# EAGLE design a (EAGLE 9.6.2)
Assembly variants: basic
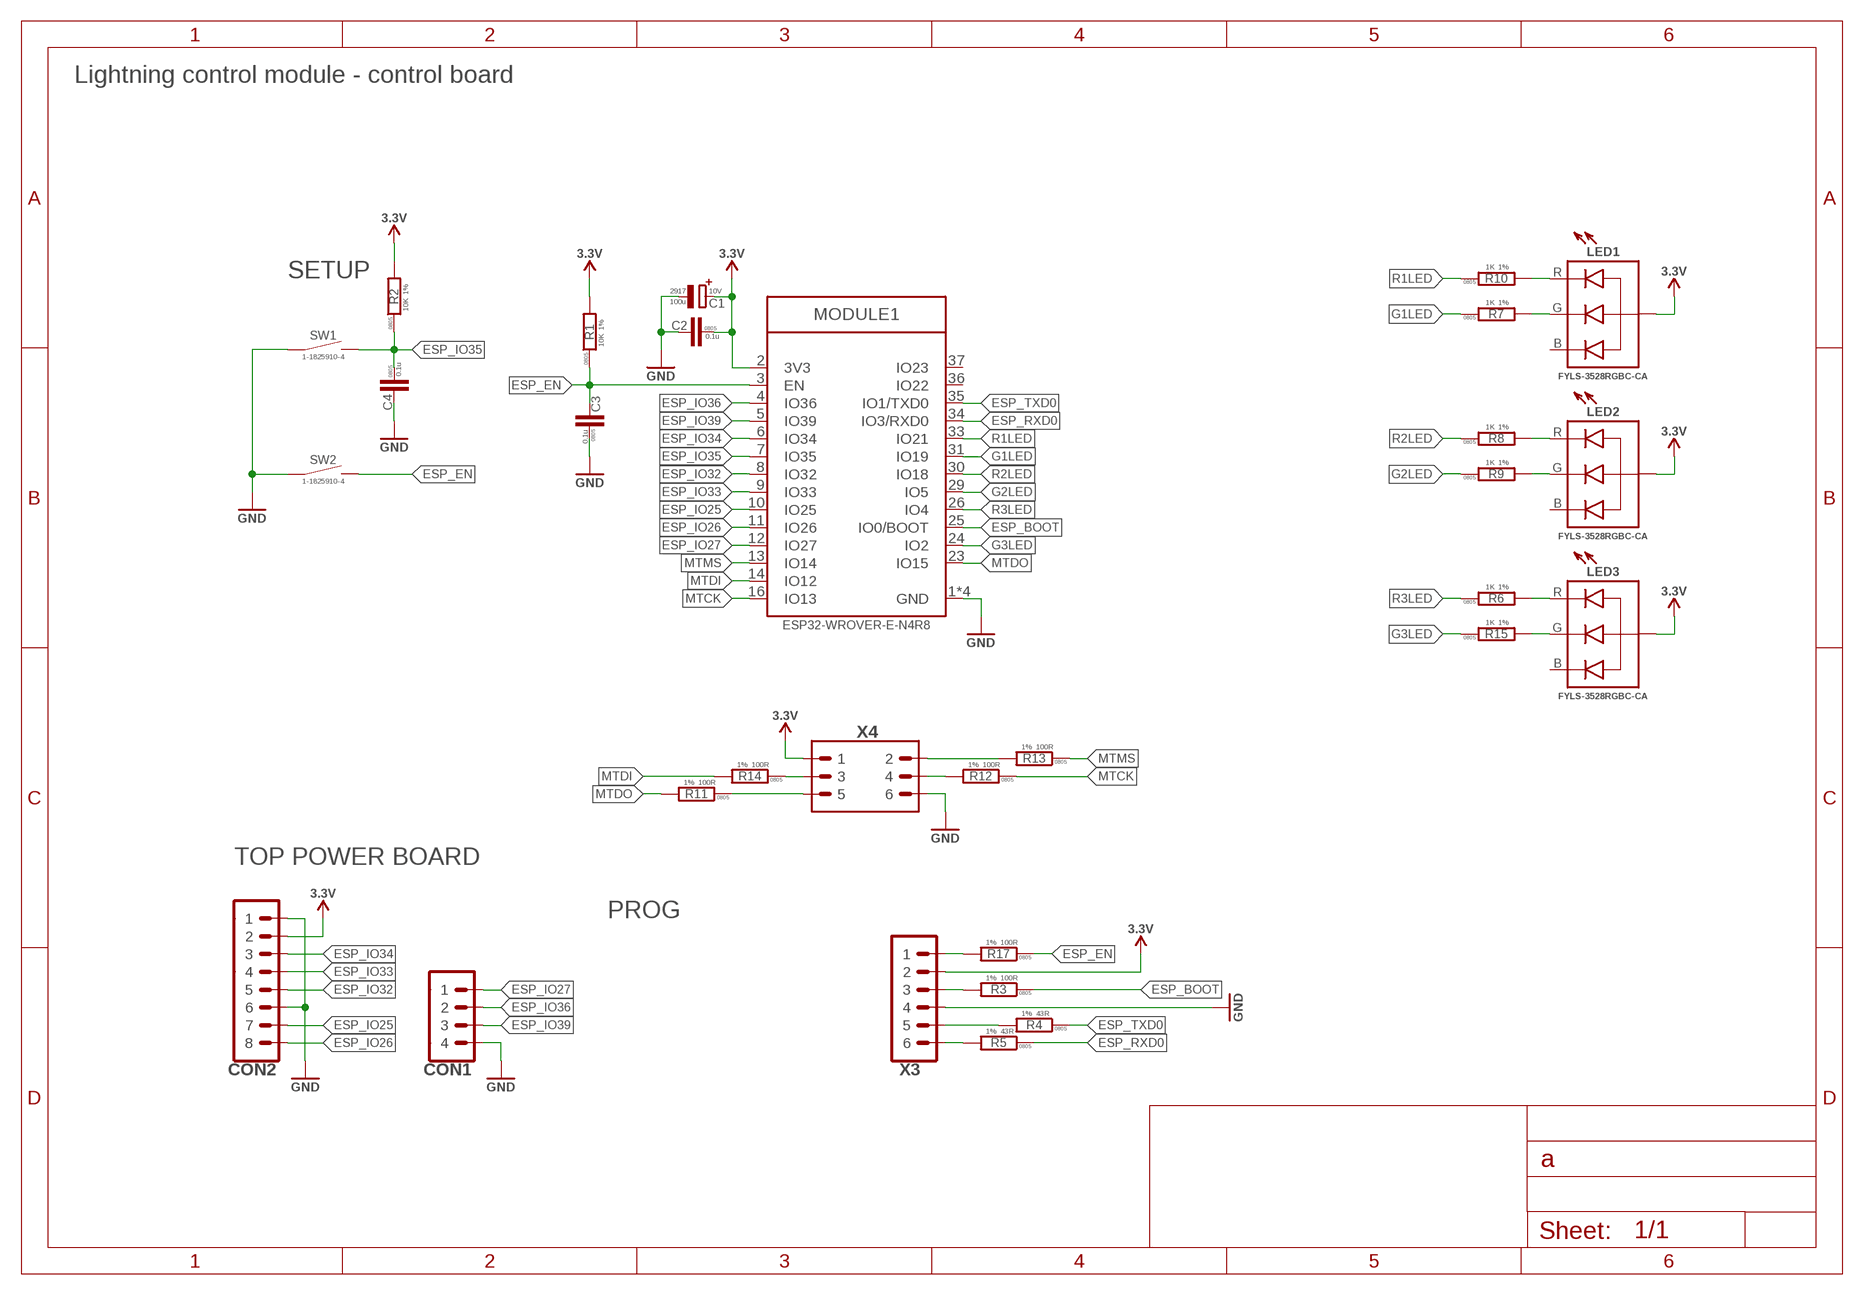
[diagram p0: schematic, sheet 1]

## Parts
C1  100u  CPOL-2917  [C2917]
C2  0.1u  C-0805  [C0805]
C3  0.1u  C-0805  [C0805]
C4  0.1u  C-0805  [C0805]
CON1  PINHEAD_1X04-2.54  [1X04-PTH-2.54]
CON2  PINHEAD_1X08-2.54  [1X08-PTH-2.54]
LED1  LED_RGB-3528  [LED3528]
LED2  LED_RGB-3528  [LED3528]
LED3  LED_RGB-3528  [LED3528]
MODULE1  ESP32-WROVER-(I)E  [ESP32-WROVER-E]
R1  10K  R-1%-0805  [R0805]
R2  10K  R-1%-0805  [R0805]
R3  100R  R-1%-0805  [R0805]
R4  43R  R-1%-0805  [R0805]
R5  43R  R-1%-0805  [R0805]
R6  1K  R-1%-0805  [R0805]
R7  1K  R-1%-0805  [R0805]
R8  1K  R-1%-0805  [R0805]
R9  1K  R-1%-0805  [R0805]
R10  1K  R-1%-0805  [R0805]
R11  100R  R-1%-0805  [R0805]
R12  100R  R-1%-0805  [R0805]
R13  100R  R-1%-0805  [R0805]
R14  100R  R-1%-0805  [R0805]
R15  1K  R-1%-0805  [R0805]
R17  100R  R-1%-0805  [R0805]
SW1  TACT_SWITCH-1-1825910-4  [1-1825910-4]
SW2  TACT_SWITCH-1-1825910-4  [1-1825910-4]
X3  PINHEAD_1X06-2-MALE  [1X06-PTH-2]
X4  PINHEAD_2X03-PTH-2.54  [2X03-PTH-2.54]

## Nets
ESP_BOOT: MODULE1.25(IO0/BOOT) R3.1
ESP_EN: C3.2 MODULE1.3(EN) R1.1 R17.1 SW2.3 SW2.4
ESP_IO25: CON2.7 MODULE1.10(IO25)
ESP_IO26: CON2.8 MODULE1.11(IO26)
ESP_IO27: CON1.1 MODULE1.12(IO27)
ESP_IO32: CON2.5 MODULE1.8(IO32)
ESP_IO33: CON2.4 MODULE1.9(IO33)
ESP_IO34: CON2.3 MODULE1.6(IO34)
ESP_IO35: C4.1 MODULE1.7(IO35) R2.1 SW1.3 SW1.4
ESP_IO36: CON1.2 MODULE1.4(IO36)
ESP_IO39: CON1.3 MODULE1.5(IO39)
ESP_RXD0: MODULE1.34(IO3/RXD0) R5.1
ESP_TXD0: MODULE1.35(IO1/TXD0) R4.1
G1LED: MODULE1.31(IO19) R7.1
G2LED: MODULE1.29(IO5) R9.1
G3LED: MODULE1.24(IO2) R15.1
GND: C1.- C2.2 C3.1 C4.2 CON1.4 CON2.1 CON2.6 MODULE1.1(GND) MODULE1.15(GND) MODULE1.38(GND) MODULE1.39(GND) SW1.1 SW1.2 SW2.1 SW2.2 X3.4 X4.6
MTCK: MODULE1.16(IO13) R12.1
MTDI: MODULE1.14(IO12) R14.2
MTDO: MODULE1.23(IO15) R11.2
MTMS: MODULE1.13(IO14) R13.1
N$1: LED2.1(R) R8.2
N$2: R13.2 X4.2
N$3: R5.2 X3.6
N$4: R4.2 X3.5
N$5: R3.2 X3.3
N$6: R12.2 X4.4
N$7: LED1.1(R) R10.2
N$8: LED1.4(G) R7.2
N$9: LED2.4(G) R9.2
N$10: LED3.1(R) R6.2
N$11: LED3.4(G) R15.2
N$14: R14.1 X4.3
N$15: R11.1 X4.5
N$17: R17.2 X3.1
R1LED: MODULE1.33(IO21) R10.1
R2LED: MODULE1.30(IO18) R8.1
R3LED: MODULE1.26(IO4) R6.1
VDD_3V3: C1.+ C2.1 CON2.2 LED1.2(A) LED2.2(A) LED3.2(A) MODULE1.2(3V3) R1.2 R2.2 X3.2 X4.1 ; supply symbol labelled 3.3V
Unconnected: LED1.3(B) LED2.3(B) LED3.3(B) MODULE1.36(IO22) MODULE1.37(IO23)

## Notes on the sheet
- Lightning control module - control board
- SETUP
- TOP POWER BOARD
- PROG

## Library data of the parts
C1 = rc:CPOL: Polar electrolytic or tantalum capacitor; PACKAGE: 2917; VOLTAGE: 10V
C2-C4 = rc:C; PACKAGE: 0805
CON1 = pinhead:PINHEAD_1X04
CON2 = pinhead:PINHEAD_1X08: pinheader 8P
LED1-LED3 = rc:LED_RGB; MANF: Foryard; MANF#: FYLS-3528RGBC-CA
MODULE1 = ali_modules:ESP32-WROVER-(I)E: ESP32-WROVER-(I)E module Datasheet <https://documentation.espressif.com/esp32-wrover-e_esp32-wrover-ie_datasheet_en.pdf>; MANF: Espressif Systems; MANF#: ESP32-WROVER-E-N4R8
R1-R15 R17 = rc:R; PACKAGE: 0805; TOLERANCE: 1%
SW1 SW2 = mechanical:TACT_SWITCH: tact switch; MANF: TE Connectivity; MANF#: 1-1825910-4
X3 = pinhead:PINHEAD_1X06: pinheader 6P
X4 = pinhead:PINHEAD_2X03

## Board
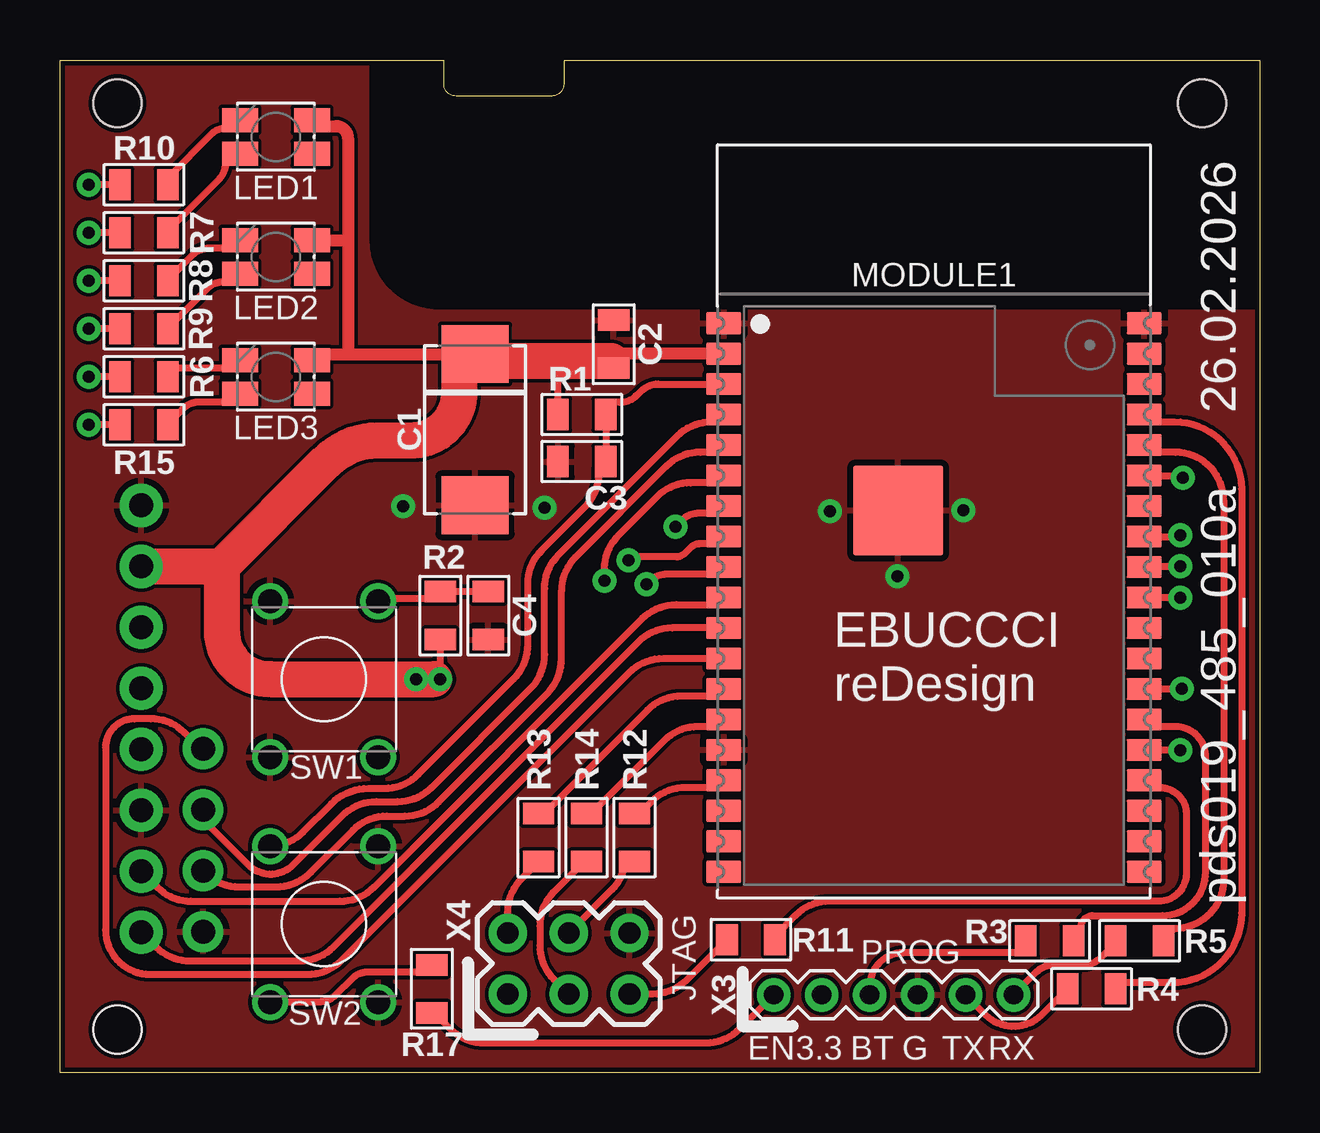
[diagram p1: board, top side]
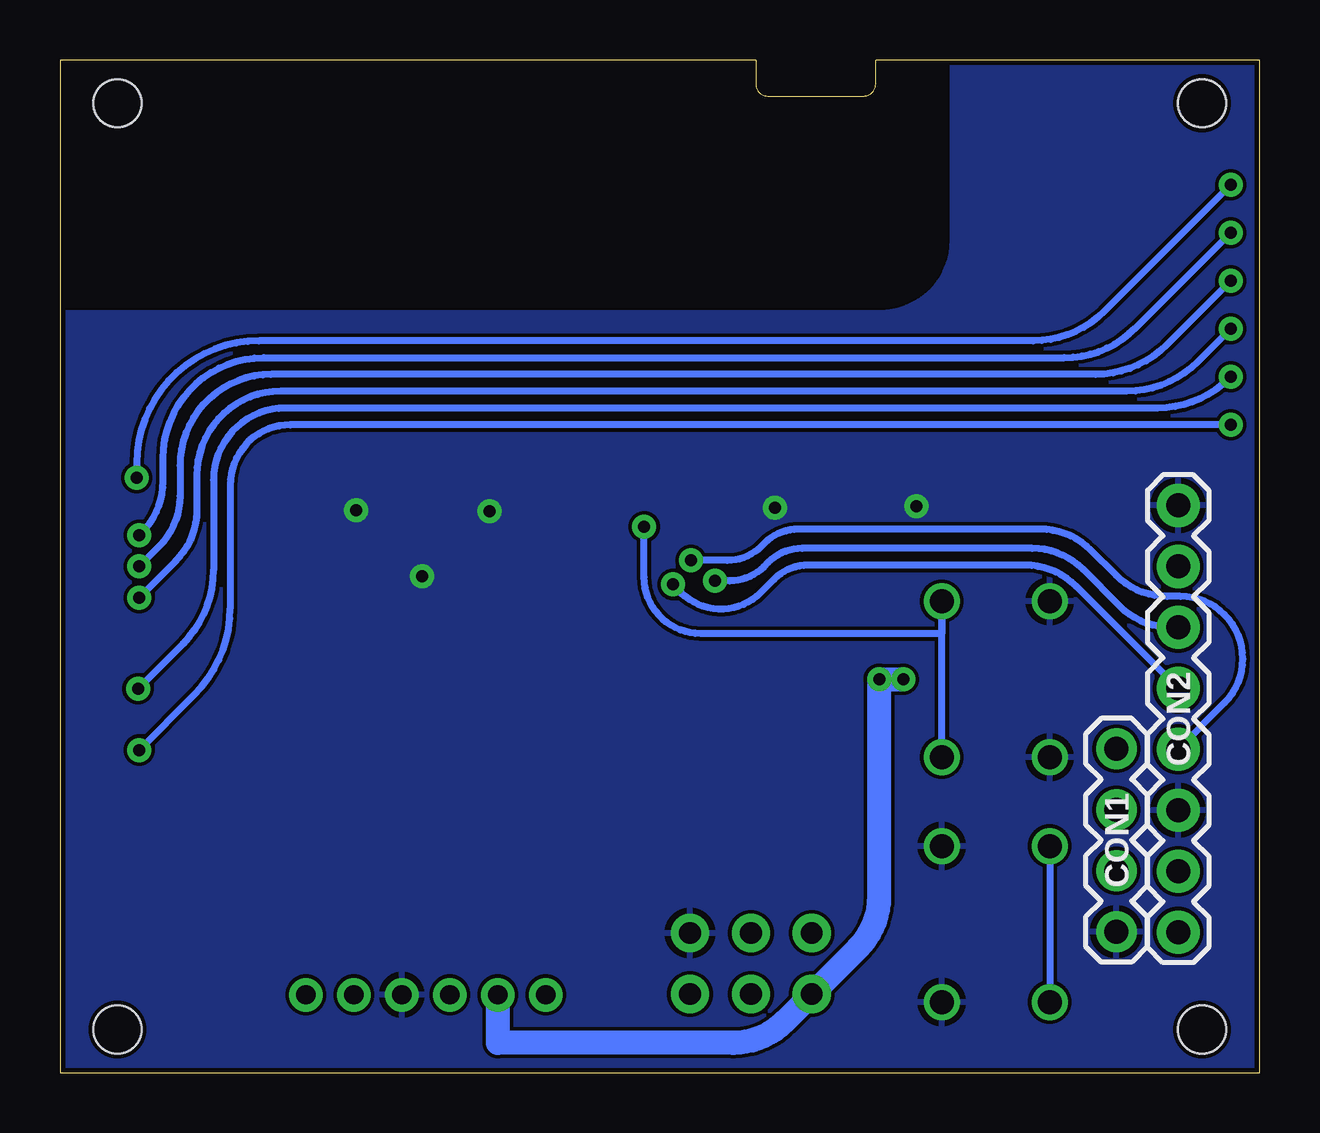
[diagram p2: board, bottom side, seen from below]

Size 50 x 42.2 mm. Coordinates in mm from the lower left corner, seen from the top.
Copper layers (1*16): Top 0.035mm / dielectric 1.5mm / Bottom 0.035mm
Design rules "JLCPCB 2 layer": minimum track width 6mil, minimum drill 0.3mm, track to track 0.15mm, track to pad 0.15mm, pad to pad 0.15mm, via to via 0.15mm, smd to smd 0.1mm, copper to edge 0.2mm, drill to drill 6mil, minimum pad ring 0.15mm, minimum via ring 0.15mm, stop-mask expansion 0.05mm, vias tented up to drill 0.5mm, thermal gap 10mil

### Footprints (pad centres in the part's own frame; a part is rotated, then mirrored left to right if it is on the bottom)
C2917 = smd 2.4 x 2.8: + -3.15,0; - 3.15,0
C0805 = smd 0.9 x 1.3: 1 -1,0; 2 1,0
1X04-PTH-2.54 = drill 1 pad 1.7: 1 -3.81,0; 2 -1.27,0; 3 1.27,0; 4 3.81,0
1X08-PTH-2.54 = drill 1 pad 1.8: 1 -8.89,0; 2 -6.35,0; 3 -3.81,0; 4 -1.27,0; 5 1.27,0; 6 3.81,0; 7 6.35,0; 8 8.89,0
LED3528 = smd 1.5 x 1: 1 1.5,-0.7; 2 -1.5,-0.7; 3 -1.5,0.7; 4 1.5,0.7
ESP32-WROVER-E = smd 1.473 x 0.914: 1 -8.763,8.255; 2 -8.763,6.985; 3 -8.763,5.715; 4 -8.763,4.445; 5 -8.763,3.175; 6 -8.763,1.905; 7 -8.763,0.635; 8 -8.763,-0.635; 9 -8.763,-1.905; 10 -8.763,-3.175; 11 -8.763,-4.445; 12 -8.763,-5.715; 13 -8.763,-6.985; 14 -8.763,-8.255; 15 -8.763,-9.525; 16 -8.763,-10.795; 17 -8.763,-12.065; 18 -8.763,-13.335; 19 -8.763,-14.605; 20 8.763,-14.605; 21 8.763,-13.335; 22 8.763,-12.065; 23 8.763,-10.795; 24 8.763,-9.525; 25 8.763,-8.255; 26 8.763,-6.985; 27 8.763,-5.715; 28 8.763,-4.445; 29 8.763,-3.175; 30 8.763,-1.905; 31 8.763,-0.635; 32 8.763,0.635; 33 8.763,1.905; 34 8.763,3.175; 35 8.763,4.445; 36 8.763,5.715; 37 8.763,6.985; 38 8.763,8.255 | smd 3.75 x 3.75: 39 -1.5,0.455
R0805 = smd 0.9 x 1.3: 1 -1,0; 2 1,0
1-1825910-4 = drill 1: 1 -3.25,2.25; 2 3.25,2.25; 3 -3.25,-2.25; 4 3.25,-2.25
REF_A = hole 2: 2.4,1.8; 47.6,1.8; 47.6,40.4; 2.4,40.4
1X06-PTH-2 = drill 0.8 pad 1.4: 1 -5,0; 2 -3,0; 3 -1,0; 4 1,0; 5 3,0; 6 5,0
2X03-PTH-2.54 = drill 0.9 pad 1.6: 1 -1.27,2.54; 2 1.27,2.54; 3 -1.27,0; 4 1.27,0; 5 -1.27,-2.54; 6 1.27,-2.54

### Placement (x,y rotation side)
C1  17.3,26.8 270 top
C2  23.08,30.36 90 top
C3  21.75,25.47 0 top
C4  17.85,19.05 270 top
CON1  5.96,9.69 270 bottom
CON2  3.39,14.75 270 bottom
LED1  9,39 180 top
LED2  9,34 180 top
LED3  9,29 180 top
MODULE1  36.43,22.98 0 top
R1  21.75,27.43 180 top
R2  15.85,19.05 270 top
R3  41.25,5.5 180 top
R4  43,3.5 180 top
R5  45,5.5 180 top
R6  3.5,29 0 top
R7  3.5,35 0 top
R8  3.5,33 0 top
R9  3.5,31 0 top
R10  3.5,37 0 top
R11  28.8,5.55 0 top
R12  23.95,9.8 270 top
R13  19.95,9.8 270 top
R14  21.95,9.8 90 top
R15  3.5,27 0 top
R17  15.5,3.5 270 top
SW1  11,16.4 90 top
SW2  11,6.2 270 top
U$1  [REF_A]  0,0 0 top
X3  34.75,3.25 0 top
X4  21.2,4.55 90 top

### Tracks (layer width: path | path; a pad name or v marks a point on that pad's centre or on a via)
ESP_BOOT
  Top 0.3: MODULE1.25 45.49,14.43 46.5,14.43 arc-90 47.75,13.18 47.75,8.35 arc-90 45.95,6.55 43.05,6.55 arc90 42.55,6.05 42.55,5.5 R3.1
ESP_EN
  Top 0.3: MODULE1.3 24.93,28.7 arc45 24.22,28.4 24.04,28.22 arc-45 23.34,27.93 22.75,27.93 R1.1 C3.2 22.45,25.17 22.45,24.98 arc-45 21.86,23.56 20.09,21.79 arc45 19.5,20.37 19.5,17.83 arc-45 18.91,16.41 14.94,12.44 arc-45 13.52,11.85 12.85,11.85 arc45 11.31,11.21 10.12,10.02 arc-45 SW2.3 | R17.1 15.5,4.2 12.86,4.2 arc45 12.16,3.91 11.49,3.24 arc-45 10.79,2.95 SW2.4
  Bottom 0.3: SW2.3 SW2.4
ESP_IO25
  Top 0.3: MODULE1.10 27.37,19.5 25.68,19.5 arc45 24.27,18.92 13.09,7.74 arc-45 11.67,7.15 5.47,7.15 arc-45 4.05,7.74 CON2.7
ESP_IO26
  Top 0.3: MODULE1.11 25.51,18.54 arc45 24.1,17.95 11.39,5.24 arc-45 9.97,4.65 5.43,4.65 arc-45 4.01,5.24 CON2.8
ESP_IO27
  Top 0.3: MODULE1.12 25.14,17.27 arc45 23.73,16.68 11.74,4.69 arc-45 10.32,4.1 3.75,4.1 arc-90 1.9,5.95 1.9,13.55 arc-90 3.1,14.75 3.78,14.75 arc-45 5.2,14.16 5.86,13.5 CON1.1
ESP_IO32  (via drill 0.5 pad 1)
  Top 0.3: MODULE1.8 27.37,22.05 26.69,22.05 arc45 26.27,21.87 26.04,21.64 arc-45 25.7,21.5 23.85,21.5 v23.7,21.35
  Bottom 0.3: CON2.5 1.46,15.41 arc-135 3.3,19.85 3.86,19.85 arc45 5.98,20.73 7.02,21.77 arc-45 9.14,22.65 19.22,22.65 arc-45 20.64,22.06 20.76,21.94 arc45 22.18,21.35 v23.7,21.35
ESP_IO33  (via drill 0.5 pad 1)
  Top 0.3: MODULE1.9 27.37,20.77 25.29,20.77 arc45 24.58,20.48 v24.45,20.35
  Bottom 0.3: CON2.4 7.64,20.27 arc-45 9.76,21.15 18.82,21.15 arc-45 20.24,20.56 20.79,20.01 arc90 24.11,20.01 v24.45,20.35
ESP_IO34  (via drill 0.5 pad 1)
  Top 0.3: MODULE1.6 27.37,24.59 26.3,24.59 arc45 24.88,24 23.29,22.4 arc45 22.7,20.99 v22.7,20.5
  Bottom 0.3: CON2.3 3.7,18.56 arc45 5.82,19.44 7.35,20.97 arc-45 9.47,21.85 19.07,21.85 arc-45 20.49,21.26 20.66,21.09 arc45 22.08,20.5 v22.7,20.5
ESP_IO35  (via drill 0.5 pad 1)
  Top 0.3: C4.1 R2.1 15.55,19.75 13.35,19.75 SW1.4 | MODULE1.7 27.37,23.32 26.63,23.32 arc45 25.92,23.02 v25.65,22.75
  Bottom 0.3: v25.65,22.75 25.65,20.65 arc-90 23.3,18.3 13.25,18.3 SW1.4 SW1.3
ESP_IO36
  Top 0.3: MODULE1.4 27.37,27.12 27.15,27.12 arc45 25.74,26.54 20.79,21.59 arc45 20.2,20.17 20.2,17.43 arc-45 19.61,16.01 15.49,11.89 arc-45 14.07,11.3 13.18,11.3 arc45 11.76,10.71 9.72,8.67 arc-90 7.85,8.67 6.24,10.28 arc-45 CON1.2
ESP_IO39
  Top 0.3: MODULE1.5 27.37,25.86 26.68,25.86 arc45 25.27,25.27 21.49,21.49 arc45 20.9,20.07 20.9,17.23 arc-45 20.31,15.81 15.79,11.29 arc-45 14.37,10.7 13.63,10.7 arc45 12.21,10.11 10.45,8.35 arc-45 9,7.75 7.46,7.75 arc-45 6.04,8.34 CON1.3
ESP_RXD0
  Top 0.3: MODULE1.34 45.49,25.86 46.5,25.86 arc-90 48.5,23.86 48.5,8.05 arc-90 46.45,6 46,6 R5.1
ESP_TXD0
  Top 0.3: MODULE1.35 45.49,27.12 46.45,27.12 arc-90 49.25,24.32 49.25,6.65 arc-90 46.35,3.75 44.25,3.75 R4.1
G1LED  (via drill 0.5 pad 1)
  Top 0.3: R7.1 v1.2,35 | MODULE1.31 46.65,22.34 v46.7,22.4
  Bottom 0.3: v1.2,35 5.17,31.03 arc45 8.14,29.8 41.5,29.8 arc-90 45.7,25.6 45.7,24.64 arc45 46.58,22.52 v46.7,22.4
G2LED  (via drill 0.5 pad 1)
  Top 0.3: R9.1 v1.2,31 | MODULE1.29 v46.7,19.8
  Bottom 0.3: v1.2,31 2.57,29.63 arc45 5.54,28.4 40.8,28.4 arc-90 44.3,24.9 44.3,23.44 arc45 45.18,21.32 v46.7,19.8
G3LED  (via drill 0.5 pad 1)
  Top 0.3: R15.1 v1.2,27 | MODULE1.24 v46.7,13.46 v46.7,13.45
  Bottom 0.3: v46.7,13.45 44.4,15.75 arc-45 42.9,19.37 42.9,24.5 arc90 40.4,27 v1.2,27
GND  (via drill 0.5 pad 1)
  other vias: 14.3,23.6 20.2,23.55 32.1,23.4 34.9,20.7 37.65,23.45
  pour Top: 0,42.2 0,0 50,0 50,31.7 15.8,31.7 arc-90 12.8,34.7 12.8,42.2
  pour Bottom: 0,42.2 0,0 50,0 50,31.7 26.7,31.7 15.8,31.7 arc-90 12.8,34.7 12.8,39.4 12.8,42.2
MTCK
  Top 0.3: MODULE1.16 27.37,11.88 26.06,11.88 arc45 24.65,11.3 24.15,10.8 R12.1
MTDI
  Top 0.3: MODULE1.14 27.37,14.43 26.59,14.43 arc45 25.18,13.84 22.45,11.11 22.45,10.8 R14.2
MTDO
  Top 0.3: MODULE1.23 45.49,11.88 45.85,11.88 arc-90 46.95,10.79 46.95,8.3 arc-90 45.8,7.15 32.08,7.15 arc45 30.66,6.56 29.8,5.7 R11.2
MTMS
  Top 0.3: MODULE1.13 27.37,15.7 25.89,15.7 arc45 24.48,15.11 20.17,10.8 R13.1
N$1
  Top 0.3: LED2.1 7.15,34.35 6.21,34.35 arc45 5.51,34.06 4.5,33.05 R8.2
N$2
  Top 0.3: R13.2 19.24,8.09 arc45 18.65,6.67 X4.2
N$3
  Top 0.3: X3.6 40.71,4.21 arc-45 41.41,4.5 42.69,4.5 arc45 43.39,4.79 44,5.4 R5.2
N$4
  Top 0.3: R4.2 40.91,2.41 arc-90 38.59,2.41 X3.5
N$5
  Top 0.3: R3.2 40.25,5 35.15,5 arc90 33.75,3.6 X3.3
N$6
  Top 0.3: R12.2 23.5,8.8 arc-45 23.02,7.64 X4.4
N$7
  Top 0.3: LED1.1 7.15,39.35 6.87,39.35 arc45 6.32,39.12 4.5,37.3 R10.2
N$8
  Top 0.3: LED1.4 6.9,38.3 6.9,37.91 arc-45 6.61,37.21 4.9,35.5 4.5,35.5 R7.2
N$9
  Top 0.3: R9.2 4.5,31.05 6.11,32.66 arc-45 6.81,32.95 7.15,32.95 LED2.4
N$10
  Top 0.3: LED3.1 7.15,29.35 4.5,29.35 R6.2
N$11
  Top 0.3: R15.2 4.5,27.05 5.11,27.66 arc-45 5.81,27.95 7.15,27.95 LED3.4
N$14
  Top 0.3: R14.1 21.85,8.8 20.59,7.54 arc45 20,6.12 20,5.31 arc45 20.59,3.89 X4.3
N$15
  Top 0.3: R11.1 26.12,3.87 arc-45 24.7,3.28 X4.5
N$17
  Top 0.3: R17.2 15.6,2.5 16.26,1.84 arc45 17.68,1.25 26.92,1.25 arc45 28.34,1.84 X3.1
R1LED  (via drill 0.5 pad 1)
  Top 0.3: R10.1 v1.2,37 | MODULE1.33 46.8,24.89 v46.8,24.8
  Bottom 0.3: v46.8,24.8 46.8,25.4 arc90 41.7,30.5 9.44,30.5 arc-45 6.47,31.73 v1.2,37
R2LED  (via drill 0.5 pad 1)
  Top 0.3: R8.1 v1.2,33 | MODULE1.30 45.22,21.1 v46.7,21.1
  Bottom 0.3: v1.2,33 3.87,30.33 arc45 6.84,29.1 41.2,29.1 arc-90 45,25.3 45,24.04 arc45 45.88,21.92 v46.7,21.1
R3LED  (via drill 0.5 pad 1)
  Top 0.3: R6.1 v1.2,29 | MODULE1.26 v46.74,15.99 v46.75,16
  Bottom 0.3: v46.75,16 44.87,17.88 arc-45 43.6,20.95 43.6,24.7 arc90 40.6,27.7 4.24,27.7 arc-45 1.27,28.93 v1.2,29
VDD_3V3  (via drill 0.5 pad 1)
  Top 0.3: v15.85,16.4 15.6,16.4 15.85,16.65 R2.2 | R1.2 20.75,29.45 20.95,29.65 | C2.1 22.98,29.46 22.98,29.65 22.98,29.96
  Top 0.5: MODULE1.2 22.98,29.96 | LED1.2 10.5,39.45 11.5,39.45 arc-90 12,38.95 12,34.7 | 12,29.95 10.75,29.95 LED3.2 | 12,34.7 12,29.95 | LED2.2 12,34.7 | 12,29.95 16.65,29.95 C1.+
  Top 1.5: CON2.2 6.75,21.1 | 22.98,29.65 20.95,29.65 17.6,29.65 C1.+ | 6.75,21.1 6.75,18.4 arc90 8.75,16.4 15.6,16.4 | 6.75,21.1 11.12,25.47 arc-45 13.24,26.35 14.65,26.35 arc90 16.65,28.35 16.65,29.95
  Bottom 1: v14.85,16.4 v15.85,16.4 15.85,7.33 arc45 16.73,5.21 X4.1 19.81,2.13 arc45 21.93,1.25 31.75,1.25 X3.2

### Text on the board
tPlace: 26.02.2026 | EBUCCCI / reDesign | pds019_485_010a | PROG | JTAG | EN | 3.3 | BT | G | TX | RX
Notes: 2 layer PCB / Copper thickness 35 uM / Soldermask color blue / PCB thickness 2 mm